# Altium schematic sheet schematic.SchDoc: Brushed Motor Controller
size Letter; Date: April 2020; DrawnBy: Kyle Hong; DocumentNumber: 1; Revision: 1; SheetNumber: 1; SheetTotal: 1
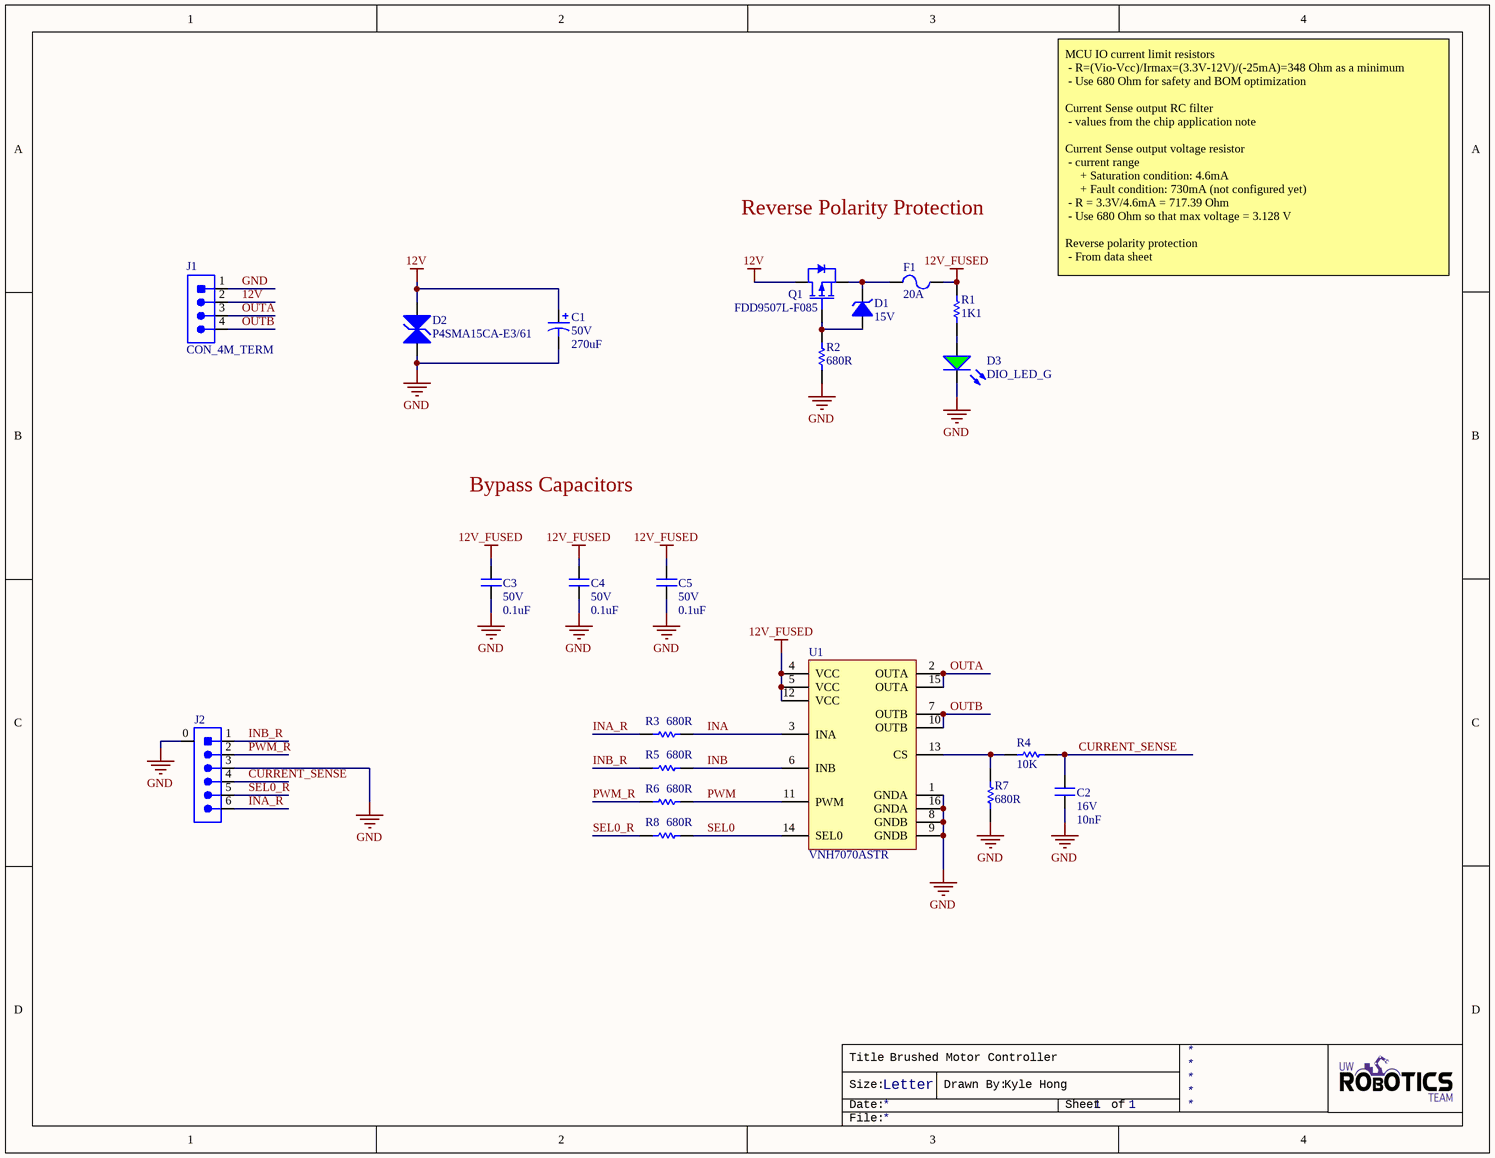
[diagram p0: schematic.SchDoc]

## Parts
C1  Voltage Rating: 50V  Capacitance: 270uF  [RADIAL_PANASONIC_G]  (hidden comment: CAP_270uF_50V_ALUM)
C2  value 10nF  Voltage Rating: 16V  [CAPC0603(1608)55_N]  (hidden comment: CAP_10nF_0603)
C3  value 0.1uF  Voltage Rating: 50V  [CAPC0603(1608)55_N]  (hidden comment: CAP_0.1uF_50V_0603)
C4  value 0.1uF  Voltage Rating: 50V  [CAPC0603(1608)55_N]  (hidden comment: CAP_0.1uF_50V_0603)
C5  value 0.1uF  Voltage Rating: 50V  [CAPC0603(1608)55_N]  (hidden comment: CAP_0.1uF_50V_0603)
D1  Zener Voltage: 15V  [SOD-323]  (hidden comment: DIO_ZENER_15V)
D2  Manufacturer Part Number 1: P4SMA15CA-E3/61  [TVS_DIODE_BIDIR_DO-214AC_SMA]  (hidden comment: TVS_DIODE_BIDIR_12.8V)
D3  DIO_LED_G  [LED_0805_LINE]
F1  Current Rating: 20A  [FUSE_1206]  (hidden comment: FUSE_20A_1206)
J1  CON_4M_TERM  [1935187]
J2  CON_6M_SM_RA  [MOLEX-5024940670]  (value not drawn)
Q1  Manufacturer Part Number 1: FDD9507L-F085  [D-PAK]  (hidden comment: PMOS_40V_100A)
R1  value 1K1  [RESC0603(1608)_N]  (hidden comment: 1.1K 1%)
R2  Resistance: 680R  [RESC0603(1608)_N]  (hidden comment: RES_680R_0603)
R3  Resistance: 680R  [RESC0603(1608)_N]  (hidden comment: RES_680R_0603)
R4  value 10K  [RESC0603(1608)_N]  (hidden comment: RES_10K_0603)
R5  Resistance: 680R  [RESC0603(1608)_N]  (hidden comment: RES_680R_0603)
R6  Resistance: 680R  [RESC0603(1608)_N]  (hidden comment: RES_680R_0603)
R7  Resistance: 680R  [RESC0603(1608)_N]  (hidden comment: RES_680R_0603)
R8  Resistance: 680R  [RESC0603(1608)_N]  (hidden comment: RES_680R_0603)
U1  Manufacturer Part Number 1: VNH7070ASTR  [SO-16N]  (hidden comment: IC_MOTOR_DRIVER_ST)

## Nets
12V: C1.1 D2.1 J1.2 Q1.2(Drain)
12V_FUSED: C3.2 C4.2 C5.1 F1.2 R1.2 U1.4(VCC) U1.5(VCC) U1.12(VCC)
GND: C1.2 C2.1 C3.1 C4.1 C5.2 D2.2 D3.2(K) J1.1 J2.0 J2.3 R2.1 R7.1 U1.1(GNDA) U1.8(GNDB) U1.9(GNDB) U1.16(GNDA)
CURRENT_SENSE: C2.2 J2.4 R4.2
INA: R3.2 U1.3(INA)
INA_R: J2.6 R3.1
INB: R5.2 U1.6(INB)
INB_R: J2.1 R5.1
OUTA: J1.3 U1.2(OUTA) U1.15(OUTA)
OUTB: J1.4 U1.7(OUTB) U1.10(OUTB)
PWM: R6.2 U1.11(PWM)
PWM_R: J2.2 R6.1
SEL0: R8.2 U1.14(SEL0)
SEL0_R: J2.5 R8.1
NetD1_1: D1.1(Anode) Q1.1(Gate) R2.2
NetD1_2: D1.2(Cathode) F1.1 Q1.3(Source)
NetD3_1: D3.1(A) R1.1
NetR4_1: R4.1 R7.2 U1.13(CS)

## Notes on the sheet
- Reverse Polarity Protection
- MCU IO current limit resistors
  - R=(Vio-Vcc)/Irmax=(3.3V-12V)/(-25mA)=348 Ohm as a minimum
  - Use 680 Ohm for safety and BOM optimization
  Current Sense output RC filter
  - values from the chip application note
  Current Sense output voltage resistor
  - current range
  + Saturation condition: 4.6mA
  + Fault condition: 730mA (not configured yet)
  - R = 3.3V/4.6mA = 717.39 Ohm
  - Use 680 Ohm so that max voltage = 3.128 V
  Reverse polarity protection
  - From data sheet
- Bypass Capacitors
- Title
- Size:
- Date:
- Letter
- Drawn By:
- Sheet
- of
- File:

## Library data of the parts
C1 = CAP_270uF_50V_ALUM: CAP ALUM 270UF 20% 50V RADIAL; Manufacturer 1: Panasonic; Manufacturer Part Number 1: EEEFK1H271SP; ESR (Equivalent Series Resistance): 180mR; Polarity: Polar; Ripple Current: 435.5mA; Life (Hours): 2000Hour; Ripple Current (AC): 670mA; Supplier 1: Digi-Key; Stock 1: 730; Pricing 1: 1=0.98000, 10=0.74800, 100=0.53500 (USD); RoHS: Yes; Mount: Surface Mount; Case/Package: Radial; Min Operating Temperature: -55°C; Max Operating Temperature: 105°C; Tolerance: 20%; Package Quantity: 500; Packaging: Cut Tape; Voltage Rating (DC): 50V; Diameter: 10mm; Height: 10.2mm; Height - Seated (Max): 0.413inch; REACH SVHC: Unknown; ComponentLink1URL: https://media.digikey.com/pdf/Data%20Sheets/Panasonic%20Capacitors%20PDFs/FKS_Series_Type_V.pdf?src-supplier=Digi-Key; ComponentLink1Description: https://media.digikey.com/pdf/Data%20Sheets/Panasonic%20Capacitors%20PDFs/FKS_Series_Type_V.pdf?src-supplier=Digi-Key; ComponentLink2URL: https://media.digikey.com/pdf/Data%20Sheets/Panasonic%20Capacitors%20PDFs/FKS-V_Series_NPI.pdf?src-supplier=Digi-Key; ComponentLink2Description: https://media.digikey.com/pdf/Data%20Sheets/Panasonic%20Capacitors%20PDFs/FKS-V_Series_NPI.pdf?src-supplier=Digi-Key; ComponentLink3URL: http://www.farnell.com/datasheets/2813662.pdf?src-supplier=Farnell; ComponentLink3Description: http://www.farnell.com/datasheets/2813662.pdf?src-supplier=Farnell; ComponentLink4URL: http://www.farnell.com/datasheets/1996420.pdf?src-supplier=Element14; ComponentLink4Description: http://www.farnell.com/datasheets/1996420.pdf?src-supplier=Element14; ComponentLink5URL: https://industrial.panasonic.com/cdbs/www-data/pdf/RDE0000/DME0000COL90.pdf?src-supplier=Digi-Key; ComponentLink5Description: https://industrial.panasonic.com/cdbs/www-data/pdf/RDE0000/DME0000COL90.pdf?src-supplier=Digi-Key; Supplier Part Number 1: P18967CT-ND
C2 = CAP_10nF_0603: CAP CER 10000PF 16V X7R 0603; Manufacturer Part Number 1: CC0603KRX7R7BB103; Manufacturer 1: Yageo; Dimensions: 0.063" L x 0.031" W (1.60mm x 0.80mm); Package: 0603 (1608 Metric); Temperature Coefficient: X7R; Supplier Part Number 1: 311-3369-1-ND; Supplier 1: Digi-Key; Mount: Surface Mount
C3-C5 = CAP_0.1uF_50V_0603: CAP CER 0.1UF 50V X7R 0603; Manufacturer Part Number 1: CC0603KRX7R9BB104; Manufacturer 1: Yageo; Dimensions: 0.063" L x 0.031" W (1.60mm x 0.80mm); Package: 0603 (1608 Metric); Temperature Coefficient: X7R; Supplier Part Number 1: 311-1344-1-ND; Supplier 1: Digi-Key; Mount: Surface Mount
D1 = DIO_ZENER_15V: DIODE ZENER 15V 300mW SMD SOD-323; Manufacturer 1: ON Semiconductor; Manufacturer Part Number 1: MM3Z15VT1G; Material: Plastic; Max Power Dissipation: 200mW; Tolerance: 5%; Element Configuration: Single; Impedance: 30R; Zener Current: 10mA; Max Reverse Leakage Current: 50nA; Test Current: 5mA; Forward Voltage: 900mV; Breakdown Voltage: 15.8V; ESD Protection: Yes; ComponentLink1URL: https://datasheet.ciiva.com/16292/mm3z12vst1g-16292931.pdf?src-supplier=Future+Electronics; ComponentLink1Description: https://datasheet.ciiva.com/16292/mm3z12vst1g-16292931.pdf?src-supplier=Future+Electronics; ComponentLink2URL: https://datasheet.ciiva.com/30478/0900766b8127c8bd-30478408.pdf?src-supplier=RSComponents; ComponentLink2Description: https://datasheet.ciiva.com/30478/0900766b8127c8bd-30478408.pdf?src-supplier=RSComponents; ComponentLink3URL: https://datasheet.ciiva.com/22626/1878251-22626885.pdf?src-supplier=Element14; ComponentLink3Description: https://datasheet.ciiva.com/22626/1878251-22626885.pdf?src-supplier=Element14; ComponentLink4URL: https://datasheet.ciiva.com/894/mm3z2v4st1-d-894651.pdf?src-supplier=Digi-Key; ComponentLink4Description: https://datasheet.ciiva.com/894/mm3z2v4st1-d-894651.pdf?src-supplier=Digi-Key; ComponentLink5URL: https://datasheet.ciiva.com/894/mm3z2v4st1-d-894649.pdf?src-supplier=Digi-Key; ComponentLink5Description: https://datasheet.ciiva.com/894/mm3z2v4st1-d-894649.pdf?src-supplier=Digi-Key; ComponentLink6URL: https://datasheet.ciiva.com/25928/mm3z2v4st1-d-25928489.pdf?src-supplier=Avnet+Europe; ComponentLink6Description: https://datasheet.ciiva.com/25928/mm3z2v4st1-d-25928489.pdf?src-supplier=Avnet+Europe; ComponentLink7URL: https://datasheet.ciiva.com/894/mm3z2v4st1-d-894650.pdf?src-supplier=Digi-Key; ComponentLink7Description: https://datasheet.ciiva.com/894/mm3z2v4st1-d-894650.pdf?src-supplier=Digi-Key; Supplier 1: Digi-Key; Stock 1: 57470; Pricing 1: 1=0.14000, 10=0.13000, 25=0.12360, 100=0.05450, 250=0.05228, 500=0.04276, 1000=0.02970 (USD); RoHS: Yes; Case/Package: SOD-323-2; Number of Pins: 2; Contact Plating: Tin,Matte; Min Operating Temperature: -65°C; Max Operating Temperature: 150°C; Package Quantity: 3000; Voltage Tolerance: 5%; Power Dissipation: 200mW; Packaging: Tape and Reel; Working Voltage: 15V; Peak Reverse Current: 50nA; Voltage Rating (DC): 15V; Power Rating: 200mW; Length: 1.8mm; Height: 1mm; Width: 1.35mm; Radiation Hardening: No; REACH SVHC: No SVHC; Lead Free: Lead Free; ComponentLink8URL: https://datasheet.ciiva.com/18434/70100601-18434790.pdf?src-supplier=Allied+Electronics; ComponentLink8Description: https://datasheet.ciiva.com/18434/70100601-18434790.pdf?src-supplier=Allied+Electronics; ComponentLink9URL: https://datasheet.ciiva.com/8026/mm3z2v4t1-d-8026728.pdf?src-supplier=Element14; ComponentLink9Description: https://datasheet.ciiva.com/8026/mm3z2v4t1-d-8026728.pdf?src-supplier=Element14; ComponentLink10URL: https://datasheet.ciiva.com/22626/1876691-22626888.pdf?src-supplier=Element14; ComponentLink10Description: https://datasheet.ciiva.com/22626/1876691-22626888.pdf?src-supplier=Element14; ComponentLink11URL: https://datasheet.ciiva.com/894/mm3z2v4t1-d-894601.pdf?src-supplier=Digi-Key; ComponentLink11Description: https://datasheet.ciiva.com/894/mm3z2v4t1-d-894601.pdf?src-supplier=Digi-Key; ComponentLink12URL: https://datasheet.ciiva.com/10630/mm3z2v4t1-d-10630217.pdf?src-supplier=Avnet; ComponentLink12Description: https://datasheet.ciiva.com/10630/mm3z2v4t1-d-10630217.pdf?src-supplier=Avnet; ComponentLink13URL: https://datasheet.ciiva.com/894/mm3z2v4t1-d-894602.pdf?src-supplier=Digi-Key; ComponentLink13Description: https://datasheet.ciiva.com/894/mm3z2v4t1-d-894602.pdf?src-supplier=Digi-Key; ComponentLink14URL: https://datasheet.ciiva.com/894/mm3z2v4t1-d-894603.pdf?src-supplier=Digi-Key; ComponentLink14Description: https://datasheet.ciiva.com/894/mm3z2v4t1-d-894603.pdf?src-supplier=Digi-Key; Supplier Part Number 1: MM3Z15VT1GOSCT-ND
D2 = TVS_DIODE_BIDIR_12.8V: TVS DIODE 12.8V 21.2V SMA; Manufacturer 1: Vishay Semiconductors; Element Configuration: Single; Leakage Current: 1uA; Direction: Bidirectional; Max Surge Current: 18.9A; Reverse Breakdown Voltage: 14.3V; Number of Bidirectional Channels: 1; Peak Pulse Power: 400W; Power Line Protection: No; Breakdown Voltage: 15.8V; Test Current: 1mA; Supplier 1: Digi-Key; Stock 1: 5900; Pricing 1: 1=0.38000, 10=0.31000, 25=0.28400, 100=0.17820, 250=0.17624, 500=0.16500 (USD); RoHS: Yes; Mount: Surface Mount; Case/Package: SMA; Number of Pins: 2; Min Operating Temperature: -65°C; Max Operating Temperature: 150°C; Package Quantity: 1800; Operating Supply Voltage: 12.8V; Packaging: Tape and Reel; Reverse Standoff Voltage: 12.8V; Min Breakdown Voltage: 14.3V; Clamping Voltage: 21.2V; Number of Channels: 1; Polarity: Bidirectional; Termination: SMD/SMT; Max Reverse Leakage Current: 1uA; Number of Elements: 1; Peak Pulse Current: 18.9A; Composition: Zener; Radiation Hardening: No; ComponentLink1URL: https://datasheet.ciiva.com/344/p4sma-344213.pdf?src-supplier=Digi-Key; ComponentLink1Description: https://datasheet.ciiva.com/344/p4sma-344213.pdf?src-supplier=Digi-Key; ComponentLink2URL: https://datasheet.ciiva.com/26212/p4sma-26212614.pdf?src-supplier=Avnet+Europe; ComponentLink2Description: https://datasheet.ciiva.com/26212/p4sma-26212614.pdf?src-supplier=Avnet+Europe; Supplier Part Number 1: P4SMA15CA-E3/61GICT-ND
D3 = DIO_LED_G: LED GREEN DIFFUSED 0805 SMD; MPN: LG R971-KN-1; Manufacturer: OSRAM; Forward Voltage Drop: 2.2V; Package: 0805 (2012 Metric); Supplier Part Number 1: 475-1410-1-ND; Supplier 1: Digi-Key
F1 = FUSE_20A_1206: Manufacturer 1: Littelfuse; Manufacturer Part Number 1: 0501020.WR; Body Material: Ceramic; Fuse Type: Board Mount (Cartridge Style Excluded); DC Cold Resistance: 2mR; Working Voltage: 24V; Power Dissipation: 1.1871W; Voltage Rating: 32V; Approvals: UL,CSA; Supplier 1: Digi-Key; Stock 1: 4551; Pricing 1: 1=0.96000, 5=0.93000, 10=0.87100, 50=0.72080, 100=0.60060, 250=0.58560, 500=0.49550, 1000=0.43544 (USD); RoHS: Yes; Mount: Surface Mount; Case/Package: 1206; Case Code (Imperial): 1206; Case Code (Metric): 3216; Housing Material: Ceramic; Min Operating Temperature: -55°C; Max Operating Temperature: 150°C; Termination: SMD/SMT; Fuse Current: 20A; Voltage Rating (DC): 24V; Package Quantity: 3000; Packaging: Tape and Reel; Resistance: 2mR; Length: 3.2mm; Height: 0.033inch; Depth: 1.63mm; Width: 0.064inch; Lead Free: Lead Free; REACH SVHC: No SVHC; ComponentLink1URL: https://datasheet.ciiva.com/3813/2da-3813990.pdf?src-supplier=Arrow; ComponentLink1Description: https://datasheet.ciiva.com/3813/2da-3813990.pdf?src-supplier=Arrow; ComponentLink2URL: https://datasheet.ciiva.com/1730/714013-1730635.pdf?src-supplier=Newark; ComponentLink2Description: https://datasheet.ciiva.com/1730/714013-1730635.pdf?src-supplier=Newark; ComponentLink3URL: https://datasheet.ciiva.com/46394/714013-46394876.pdf?src-supplier=Element14; ComponentLink3Description: https://datasheet.ciiva.com/46394/714013-46394876.pdf?src-supplier=Element14; ComponentLink4URL: https://datasheet.ciiva.com/299/littelfuse-fuse-501-series-299426.pdf?src-supplier=Digi-Key; ComponentLink4Description: https://datasheet.ciiva.com/299/littelfuse-fuse-501-series-299426.pdf?src-supplier=Digi-Key; ComponentLink5URL: https://datasheet.ciiva.com/299/littelfuse-fuse-501-series-299427.pdf?src-supplier=Digi-Key; ComponentLink5Description: https://datasheet.ciiva.com/299/littelfuse-fuse-501-series-299427.pdf?src-supplier=Digi-Key; ComponentLink6URL: https://datasheet.ciiva.com/299/littelfuse-fuse-501-series-299428.pdf?src-supplier=Digi-Key; ComponentLink6Description: https://datasheet.ciiva.com/299/littelfuse-fuse-501-series-299428.pdf?src-supplier=Digi-Key; Supplier Part Number 1: F2920CT-ND
J1 = CON_4M_TERM: TERM BLK 4POS SIDE ENTRY 5MM PCB; Manufacturer 1: Phoenix Contact; Current: 18A; Voltage: 300V; Wire Gauge: 12-26AWG; Wire Termination: Screw; Screw Thread: M2.6; Manufacturer Part Number 1: 1935187; Supplier Part Number 1: 277-1579-ND; Supplier 1: Digi-Key; Pitch: 5mm; Mounting Type: Through Hole
J2 = CON_6M_SM_RA: CONN HEADER SMD RIGHT ANGLE 2MM PITCH; Manufacturer 1: Molex; Manufacturer Part Number 1: 502494-0670; Insulation Resistance: 1GR; Current Rating: 3A; Voltage Rating: 250V; Connector Type: Receptacle,Forked; Number of Positions: 6; Gender: Receptacle; Glow Wire Compliant: Non-compliant; Supplier 1: Digi-Key; Stock 1: 7093; Pricing 1: 1=0.81000, 10=0.70800, 25=0.66680, 50=0.63880, 100=0.61110, 250=0.55552 (USD); RoHS: Yes; Mount: Surface Mount; Material: Polybutylene; Color: Natural; Housing Material: PBT; Housing Color: Natural; Contact Plating: Tin; Contact Material: Copper Alloy; Min Operating Temperature: -25°C; Max Operating Temperature: 85°C; Package Quantity: 950; Number of Rows: 1; Fastening Type: Latch; Packaging: Tape and Reel; Termination: Solder; Number of Contacts: 6; Orientation: Right Angle; Number of Circuits: 6; Contact Gender: Female; Max Voltage Rating (AC): 250V; Max Voltage Rating (DC): 250V; Length: 16mm; Pitch: 2mm; Depth: 6.85mm; Radiation Hardening: No; REACH SVHC: Unknown; Flammability Rating: UL94 V-0; ComponentLink1URL: https://datasheet.ciiva.com/755/5024940670-sd-755844.pdf?src-supplier=Digi-Key; ComponentLink1Description: https://datasheet.ciiva.com/755/5024940670-sd-755844.pdf?src-supplier=Digi-Key; ComponentLink2URL: https://datasheet.ciiva.com/24467/101355024940670-pcb-receptacles-24467588.pdf?src-supplier=Onlinecomponents.com; ComponentLink2Description: https://datasheet.ciiva.com/24467/101355024940670-pcb-receptacles-24467588.pdf?src-supplier=Onlinecomponents.com; ComponentLink3URL: https://datasheet.ciiva.com/16656/5024940670-pcb-receptacles-16656439.pdf?src-supplier=Avnet+Europe; ComponentLink3Description: https://datasheet.ciiva.com/16656/5024940670-pcb-receptacles-16656439.pdf?src-supplier=Avnet+Europe; ComponentLink4URL: https://datasheet.ciiva.com/7436/1630854-7436283.pdf?src-supplier=Newark; ComponentLink4Description: https://datasheet.ciiva.com/7436/1630854-7436283.pdf?src-supplier=Newark; ComponentLink5URL: https://datasheet.ciiva.com/5157/5024940670-pcb-receptacles-179322-5157180.pdf?src-supplier=Mouser; ComponentLink5Description: https://datasheet.ciiva.com/5157/5024940670-pcb-receptacles-179322-5157180.pdf?src-supplier=Mouser; ComponentLink6URL: https://datasheet.ciiva.com/7917/1630854-7917014.pdf?src-supplier=Element14; ComponentLink6Description: https://datasheet.ciiva.com/7917/1630854-7917014.pdf?src-supplier=Element14; ComponentLink7URL: https://datasheet.ciiva.com/30242/101355024940670-pcb-receptacles-30242550.pdf?src-supplier=Onlinecomponents.com; ComponentLink7Description: https://datasheet.ciiva.com/30242/101355024940670-pcb-receptacles-30242550.pdf?src-supplier=Onlinecomponents.com; ComponentLink8URL: https://datasheet.ciiva.com/755/5024940670-sd-755789.pdf?src-supplier=Digi-Key; ComponentLink8Description: https://datasheet.ciiva.com/755/5024940670-sd-755789.pdf?src-supplier=Digi-Key; Supplier Part Number 1: WM2283CT-ND
Q1 = PMOS_40V_100A: MOSFET P-CH 40V 100A D-PAK 4.4MOHM; Manufacturer 1: ON Semiconductor; FET Type: P-Channel; Vgs (Max): 16V; Power Dissipation (Max): 227W; Supplier 1: Digi-Key; Supplier Part Number 1: FDD9507L-F085OSCT-ND; Vdss: 40V; Id: 100A; Supplier Device Package: D-PAK (TO-252)
R1 = RES_1K1_0603: RES SMD 1.1K OHM 1% 1/10W 0603; Manufacturer 1: Yageo; Manufacturer Part Number: RC0603FR-071K1L; Dimensions: 0.063" L x 0.031" W (1.60mm x 0.80mm); Tolerance: 1%; Package: 0603 (1608 Metric); Supplier Part Number 1: 311-1.10KHRCT-ND; Supplier 1: Digi-Key; Mount: Surface Mount
R2 R3 R5-R8 = RES_680R_0603: RES SMD 680 OHM 5% 0.1W 0603; Manufacturer 1: Yageo; Manufacturer Part Number 1: AC0603JR-07680RL; Temperature Coefficient: 100ppm/°C; Max Power Dissipation: 100mW; Voltage Rating: 50V; Tolerance: 5%; Supplier Part Number 1: 311-680LECT-ND; Supplier 1: Digi-Key; Stock 1: 4680; Pricing 1: 1=0.10000, 10=0.02300, 100=0.00940, 1000=0.00421, 2500=0.00366 (USD); RoHS: Yes; Case/Package: 0603; Contact Plating: Tin,Matte; Case Code (Imperial): 0603; Case Code (Metric): 1608; Min Operating Temperature: -55°C; Max Operating Temperature: 155°C; Composition: Thick Film; Features: Moisture Resistant,Automotive AEC-Q200,Anti-Sulfur; Power Rating: 100mW; Packaging: Tape and Reel; Package Quantity: 1; Termination: SMD/SMT; Number of Terminations: 2; Length: 0.063inch; Height: 0.022inch; Width: 0.8mm; Radiation Hardening: No; Lead Free: Lead Free; ComponentLink1URL: http://www.yageo.com/documents/recent/PYu-AC_51_RoHS_L_2.pdf?src-supplier=Mouser; ComponentLink1Description: http://www.yageo.com/documents/recent/PYu-AC_51_RoHS_L_2.pdf?src-supplier=Mouser; ComponentLink2URL: http://www.yageo.com/documents/recent/PYu-AC_51_RoHS_L_2_revised.pdf?src-supplier=Avnet+Europe; ComponentLink2Description: http://www.yageo.com/documents/recent/PYu-AC_51_RoHS_L_2_revised.pdf?src-supplier=Avnet+Europe; ComponentLink3URL: http://www.yageo.com/NewPortal/yageodocoutput?fileName=/pdf/R-Chip/PYu-AC_51_RoHS_L_6.pdf&src-supplier=Digi-Key; ComponentLink3Description: http://www.yageo.com/NewPortal/yageodocoutput?fileName=/pdf/R-Chip/PYu-AC_51_RoHS_L_6.pdf&src-supplier=Digi-Key
R4 = RES_10K_0603: RES SMD 10K OHM 5% 1/10W 0603; Manufacturer 1: Yageo; Manufacturer Part Number 1: RC0603JR-0710KL; Package: 0603 (1608 Metric); Dimensions: 0.063" L x 0.031" W (1.60mm x 0.80mm); Tolerance: 5%; Supplier Part Number 1: 311-10KGRCT-ND; Supplier 1: Digi-Key; Mount: Surface Mount
U1 = IC_MOTOR_DRIVER_ST: IC H-BRIDGE MOTOR DRIVER 16-PINS STMicroelectronics VNH7070ASTR, SOIC; Logic Function: AND; Interface: PWM; Output Current: 15A; Supplier 1: Digi-Key; Manufacturer 1: STMicroelectronics; Stock 1: 2116; Pricing 1: 1=3.49000, 10=3.13200, 25=2.96120, 100=2.43460, 250=2.18456, 500=2.10560, 1000=1.75028 (USD); RoHS: No; Mount: Surface Mount; Case/Package: SOIC; Number of Pins: 16; Min Operating Temperature: -40°C; Max Operating Temperature: 150°C; Packaging: Tape and Reel; Lead Free: Lead Free; ComponentLink1URL: http://www.farnell.com/datasheets/2367755.pdf?src-supplier=Farnell; ComponentLink1Description: http://www.farnell.com/datasheets/2367755.pdf?src-supplier=Farnell; ComponentLink2URL: http://www.mouser.com/ds/2/389/vnh7070as-957633.pdf?src-supplier=Mouser; ComponentLink2Description: http://www.mouser.com/ds/2/389/vnh7070as-957633.pdf?src-supplier=Mouser; ComponentLink3URL: http://www.st.com/content/ccc/resource/sales_and_marketing/promotional_material/flyer/5d/08/7a/88/37/7b/43/7d/flm07hbrid.pdf/files/flm07hbrid.pdf/jcr:content/translations/en.flm07hbrid.pdf?src-supplier=Digi-Key; ComponentLink3Description: http://www.st.com/content/ccc/resource/sales_and_marketing/promotional_material/flyer/5d/08/7a/88/37/7b/43/7d/flm07hbrid.pdf/files/flm07hbrid.pdf/jcr:content/translations/en.flm07hbrid.pdf?src-supplier=Digi-Key; Supplier Part Number 1: 497-17630-1-ND